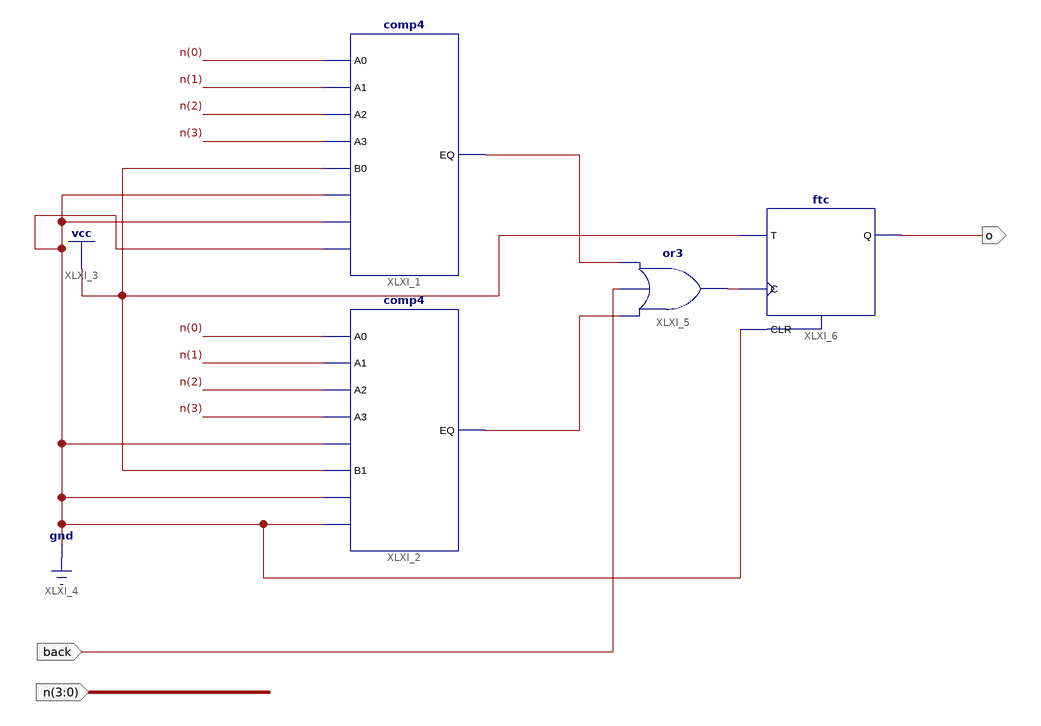
[diagram p0: schematic sheet 1]
// Xilinx ISE schematic checkDorW.sch (spartan6) as structural Verilog: 4 symbols, 3 ports
module checkDorW (
  input  [3:0] n,
  input  back,
  output o
);

  wire XLXN_9, XLXN_17, XLXN_19;

  comp4 XLXI_1 (.A0(n[0]), .A1(n[1]), .A2(n[2]), .A3(n[3]), .B0(1'b1), .B1(1'b0), .B2(1'b0), .B3(1'b0), .EQ(XLXN_9));
  comp4 XLXI_2 (.A0(n[0]), .A1(n[1]), .A2(n[2]), .A3(n[3]), .B0(1'b0), .B1(1'b1), .B2(1'b0), .B3(1'b0), .EQ(XLXN_17));
  or XLXI_5 (XLXN_19, XLXN_17, back, XLXN_9);
  ftc XLXI_6 (.C(XLXN_19), .CLR(1'b0), .T(1'b1), .Q(o));
endmodule
